# Altium schematic sheet ZRMicrocontroller.SchDoc
size A4; PageSetup: Record=PageOptions|CenterHorizontal=True|CenterVertical=True|PrintScale=0.91|XCorrection=1.00|YCorrection=1.00|PrintKind=0|BorderSize=5000000|LeftOffset=0|BottomOffset=0|Orientation=2|PaperLength=1000|PaperWidth=1000|Scale=100|PaperSource=7|PrintQuality=-3|MediaType=1|DitherType=10|PrintScaleMode=1|PaperKind=A4|PaperIndex=9
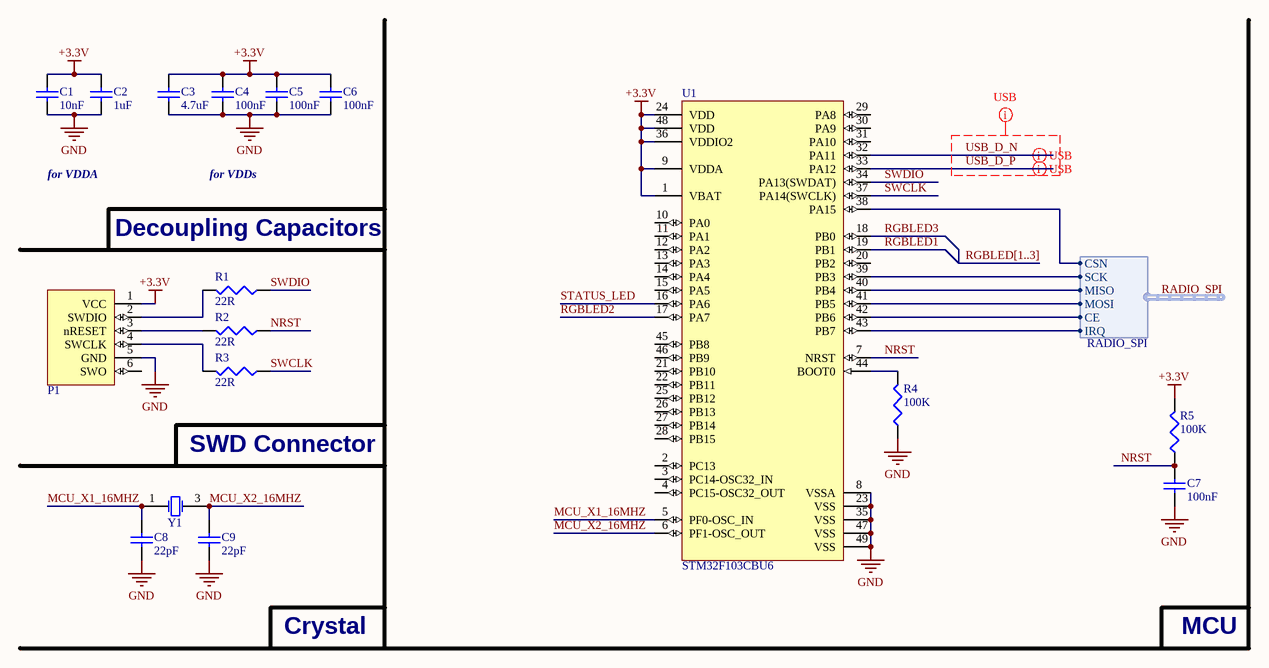
[diagram p0: ZRMicrocontroller.SchDoc]

## Parts
C1  10nF  [0402]
C2  1uF  [0603]
C3  4.7uF  [0603]
C4  100nF  [0402]
C5  100nF  [0402]
C6  100nF  [0402]
C7  100nF  [0402]
C8  22pF  [0402]
C9  22pF  [0402]
P1  TC2030-IDC-NL  [TC2030-IDC-NL]  (value not drawn)
R1  22R  [0402]
R2  22R  [0402]
R3  22R  [0402]
R4  100K  [0402]
R5  100K  [0402]
U1  STM32F103CBU6  [QFN50P700X700X60_HS-49L]
Y1  7V-16.000MAAE-T  [3.2x2.5 CRYSTAL]  (value not drawn)

## Harnesses
RADIO_SPI: MOSI, MISO, SCK, CSN, CE, IRQ

## Nets
+3.3V: C1.2 C2.2 C3.2 C4.2 C5.2 C6.2 P1.1(VCC) R5.2 U1.1(VBAT) U1.9(VDDA) U1.24(VDD) U1.36(VDDIO2) U1.48(VDD)
GND: C1.1 C2.1 C3.1 C4.1 C5.1 C6.1 C7.1 C8.1 C9.1 P1.5(GND) R4.1 U1.8(VSSA) U1.23(VSS) U1.35(VSS) U1.47(VSS) U1.49(VSS) Y1.2(GND) Y1.4(GND)
MCU_X1_16MHZ: C8.2 U1.5(PF0-OSC_IN) Y1.1(X1)
MCU_X2_16MHZ: C9.2 U1.6(PF1-OSC_OUT) Y1.3(X2)
NRST: C7.2 R2.1 R5.1 U1.7(NRST)
RADIO_SPI.CE: U1.42(PB6) ; harness RADIO_SPI.CE
RADIO_SPI.CSN: U1.38(PA15) ; harness RADIO_SPI.CSN
RADIO_SPI.IRQ: U1.43(PB7) ; harness RADIO_SPI.IRQ
RADIO_SPI.MISO: U1.40(PB4) ; harness RADIO_SPI.MISO
RADIO_SPI.MOSI: U1.41(PB5) ; harness RADIO_SPI.MOSI
RADIO_SPI.SCK: U1.39(PB3) ; harness RADIO_SPI.SCK
RGBLED1: U1.19(PB1)
RGBLED2: U1.17(PA7)
RGBLED3: U1.18(PB0)
STATUS_LED: U1.16(PA6)
SWCLK: R3.1 U1.37(PA14(SWCLK))
SWDIO: R1.1 U1.34(PA13(SWDAT))
USB_D_N: U1.32(PA11)
USB_D_P: U1.33(PA12)
NetP1_2: P1.2(SWDIO) R1.2
NetP1_3: P1.3(nRESET) R2.2
NetP1_4: P1.4(SWCLK) R3.2
NetR4_2: R4.2 U1.44(BOOT0)

Not connected (* = marked no-connect by the designer): P1 6(SWO); U1 2(PC13) 3(PC14-OSC32_IN) 4(PC15-OSC32_OUT) 10(PA0) 11(PA1) 12(PA2) 13(PA3) 14(PA4) 15(PA5) 20(PB2) 21(PB10) 22(PB11) 25(PB12) 26(PB13) 27(PB14) 28(PB15) 29(PA8) 30(PA9) 31(PA10) 45(PB8) 46(PB9)

## Buses and harness runs
bus RGBLED[1..3]

## Layout directives
differential pair: USB_D_N, USB_D_P
net class USB: USB_D_N, USB_D_P

## Notes on the sheet
- for VDDA
- Decoupling Capacitors
- for VDDs
- SWD Connector
- Crystal
- MCU

## Library data of the parts
C1 = 10nF: 10nF 0402 X7R 25V ±5%; Supplier 1: Farnell; Supplier Part Number 1: 1692285; Supplier 2: Digi-Key; Supplier Part Number 2: 399-1279-1-ND; Value: 10nF
C2 = 1uF: 1uF 0603 X5R 10V ±10%; Supplier 1: Farnell; Supplier Part Number 1: 1759399; Supplier 2: Digi-Key; Supplier Part Number 2: 478-1251-1-ND; Value: 1uF
C3 = 4.7uF: 4.7uF 0603 X5R 10V ±10%; Supplier 1: Farnell; Supplier Part Number 1: 2362098; Supplier 2: Digi-Key; Supplier Part Number 2: 445-5170-1-ND; Value: 4.7uF
C4-C7 = 100nF: 100nF 0402 X7R 16V ±10%; Supplier 1: Farnell; Supplier Part Number 1: 1288252; Supplier 2: Digi-Key; Supplier Part Number 2: 399-3521-1-ND; Value: 100nF
C8 C9 = 22pF: 22pF 0402 NP0/CG0 50V ±5%; Supplier 1: Farnell; Supplier 2: Digi-Key; Supplier Part Number 1: 1414580; Supplier Part Number 2: 490-5868-1-ND; Value: 22pF
P1 = TC2030-IDC-NL: TagConnect TC2030-IDC-NL SWD Programming Connector
R1-R3 = 22R: 22R 0402 1/16W ±1%; Supplier 1: Farnell; Supplier 2: Digi-Key; Supplier Part Number 1: 2072797; Supplier Part Number 2: 541-22.0LCT-ND; Value: 22R
R4 R5 = 100K: 100K 0402 1/16W ±1%; Supplier 1: Farnell; Supplier Part Number 1: 2072519; Supplier 2: Digi-Key; Supplier Part Number 2: 541-100KLCT-ND; Value: 100K
U1 = STM32F103CBU6: STMICROELECTRONICS  STM32F103CBU6 ARM Cortex-M3, 72 MHz, 128 KB, 20 KB, 48, VFQFPN; Supplier 1: Farnell; Supplier 2: Mouser; Supplier Part Number 1: 2060891; Supplier Part Number 2: 511-STM32F103CBU6
Y1 = 7V-16.000MAAE-T: TXC - 7V-16.000MAAE-T, 16MHZ, 30PPM, 12PF - CRYSTAL; Supplier 1: Digi-Key; Supplier 2: Farnell; Supplier Part Number 1: 887-1462-1-ND; Supplier Part Number 2: 1892172